# Altium schematic sheet Audio_Input_Digitial_Mic.SchDoc: MEMS Microphones
size 279 x 215 mm; DrawnBy: Connor Dack; Engineer: Connor Dack; DocumentNumber: 16; Revision: 1.0; SheetNumber: 16; SheetTotal: 20
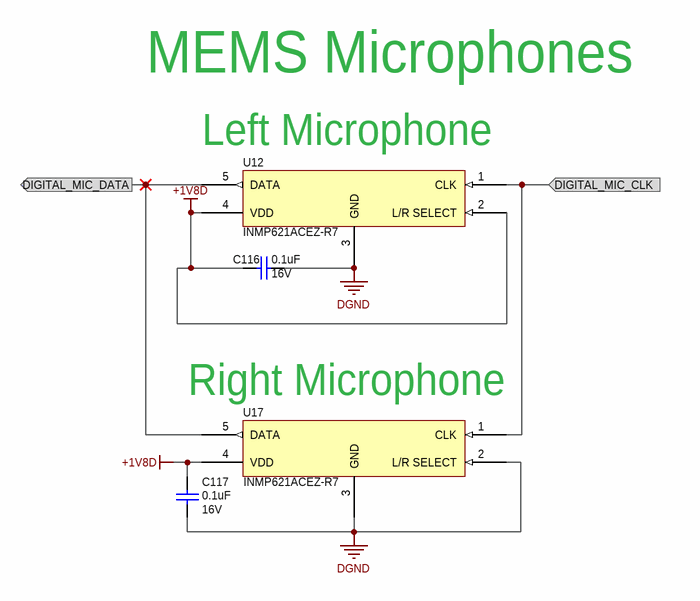
[diagram p0: Audio_Input_Digitial_Mic.SchDoc]

## Parts
C116  Voltage Rating: 16V  Capacitance: 0.1uF  [3-0603_L]  (hidden comment: CL10F104ZO8NNNC)
C117  Voltage Rating: 16V  Capacitance: 0.1uF  [3-0603_L]  (hidden comment: CL10F104ZO8NNNC)
U12  Manufacturer Part Number: INMP621ACEZ-R7  [INMP621]  (hidden comment: INMP621)
U17  Manufacturer Part Number: INMP621ACEZ-R7  [INMP621]  (hidden comment: INMP621)

## Ports
DIGITAL_MIC_CLK (in), DIGITAL_MIC_DATA (out)

## Nets
+1V8D: C116.2 C117.1 U12.2(L/R_SELECT) U12.4(VDD) U17.4(VDD)
DGND: C116.1 C117.2 U12.3(GND) U17.2(L/R_SELECT) U17.3(GND)
DIGITAL_MIC_CLK: U12.1(CLK) U17.1(CLK) ; port DIGITAL_MIC_CLK
DIGITAL_MIC_DATA: U12.5(DATA) U17.5(DATA) ; port DIGITAL_MIC_DATA

## Notes on the sheet
- MEMS Microphones
- (near U12) Left Microphone
- (near U17) Right Microphone
- Title:
- Sheet:
- of
- Size:
- 11 x 8.5 Inches
- Rev:
- Date:
- Engineer:
- Time:
- File:
- Copyright 2020 Audio Logic Inc
  THE HARDWARE IS PROVIDED "AS IS", WITHOUT WARRANTY OF ANY KIND, EXPRESS OR IMPLIED, INCLUDING BUT NOT LIMITED TO THE WARRANTIES OF MERCHANTABILITY, FITNESS FOR A PARTICULAR PURPOSE AND NONINFRINGEMENT. IN NO EVENT SHALL THE AUTHORS OR COPYRIGHT HOLDERS BE LIABLE FOR ANY CLAIM, DAMAGES OR OTHER LIABILITY, WHETHER IN AN ACTION OF CONTRACT, TORT OR OTHERWISE, ARISING FROM, OUT OF OR IN CONNECTION WITH THE HARDWARE OR THE USE OR OTHER DEALINGS IN THE HARDWARE.

## Library data of the parts
C116 C117 = CL10F104ZO8NNNC: CAP CER 0.1UF 16V Y5V 0603; Manufacturer: Samsung; Tolerance: 80%; Supplier 1: Digi-Key; Stock 1: 40000; Pricing 1: 1=0.1, 10=0.038, 100=0.0169, 500=0.01208, 1000=0.00949 (USD); Mount: Surface Mount; Case/Package: 0603; Case Code (Metric): 1608; Case Code (Imperial): 0603; Min Operating Temperature: -30°C; Max Operating Temperature: 85°C; Package Quantity: 1; Packaging: Tape and Reel; Dielectric: Y5V; Length: 1.6mm; Height: 0.8mm; Width: 0.031inch; Thickness: 0.035inch; Depth: 0.8mm; Radiation Hardening: No; ComponentLink1URL: https://datasheet.ciiva.com/25805/cl10f104zo8nnnc-25805810.pdf; ComponentLink1Description: https://datasheet.ciiva.com/25805/cl10f104zo8nnnc-25805810.pdf; ComponentLink2URL: https://datasheet.ciiva.com/16199/cl10f104zo8nnnc-16199254.pdf; ComponentLink2Description: https://datasheet.ciiva.com/16199/cl10f104zo8nnnc-16199254.pdf; Supplier Part Number 1: 1276-1258-6-ND; Manufacturer Part Number: CL10F104ZO8NNNC
U12 U17 = INMP621: 45Hz ~ 20kHz Digital, PDM Microphone MEMS (Silicon) Omnidirectional (-46dB ±2dB @ 94dB SPL) Solder Pads; Manufacturer: InvenSense; S/N Ratio: 65dB; Voltage Range: 1.62 ~ 3.63V; Current - Supply: 1.6mA; Port Location: Bottom; Seal Rating: None; Shape: Rectangular; Supplier 1: Digi-Key; RoHS: RoHS Compliant; Category: Audio Products; Stock 1: 1211; Pricing 1: 1=2.88, 10=2.491, 25=2.2292, 50=1.9668, 100=1.9012, 250=1.83568, 500=1.77012 (USD); Packaging: Cut Tape (CT); Part Status: Active; Type: MEMS (Silicon); Output Type: Digital, PDM; Direction: Omnidirectional; Frequency Range: 45Hz ~ 20kHz; Sensitivity: -46dB ±2dB @ 94dB SPL; Impedance: -; Voltage - Rated: -; Termination: Solder Pads; Size / Dimension: 4.00mm L x 3.00mm W; Height (Max): 1.10mm; ComponentLink1URL: https://www.invensense.com/wp-content/uploads/2015/02/INMP621.pdf; ComponentLink1Description: https://www.invensense.com/wp-content/uploads/2015/02/INMP621.pdf; Supplier Part Number 1: 1428-1018-1-ND